# EAGLE board MJ838 - rev.1b (EAGLE 9.6.2)
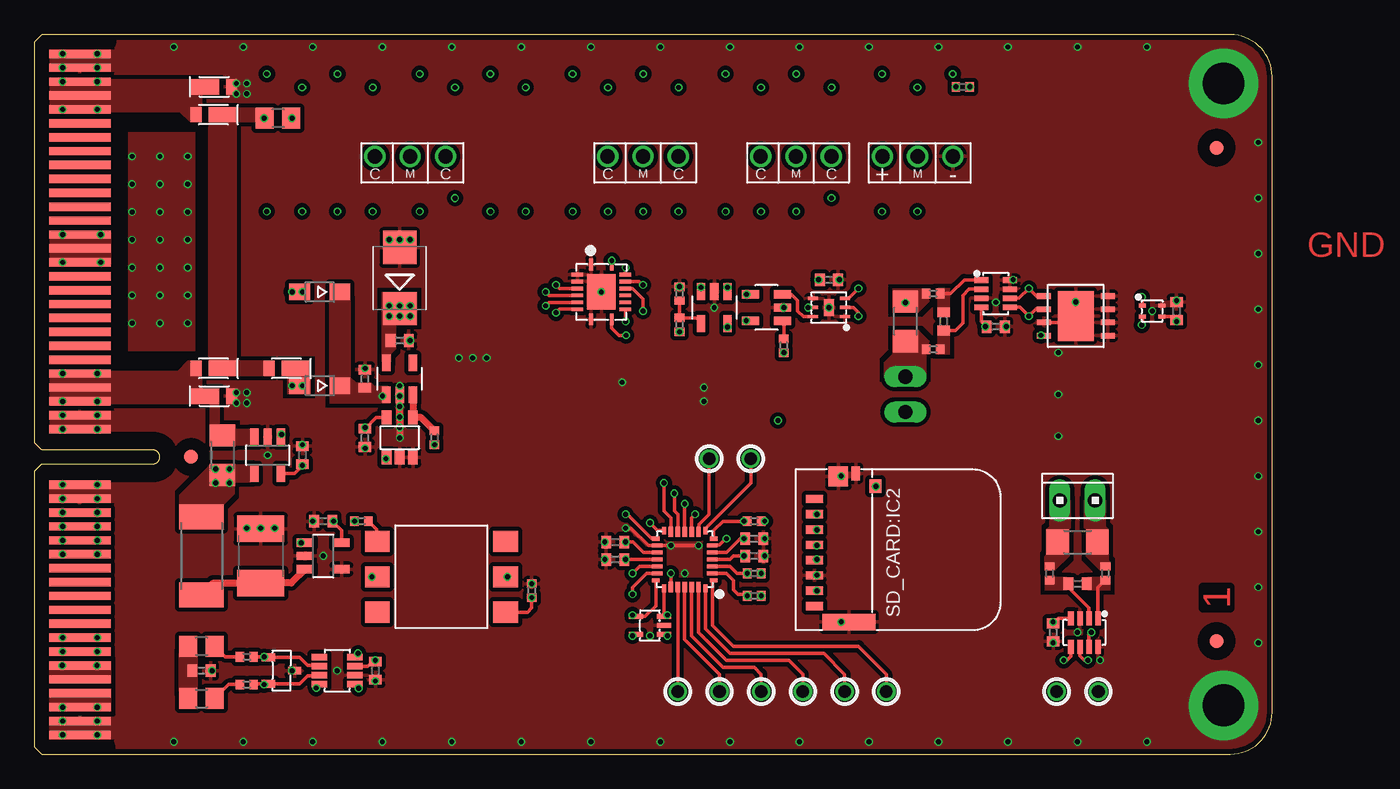
[diagram p20: board, top side]
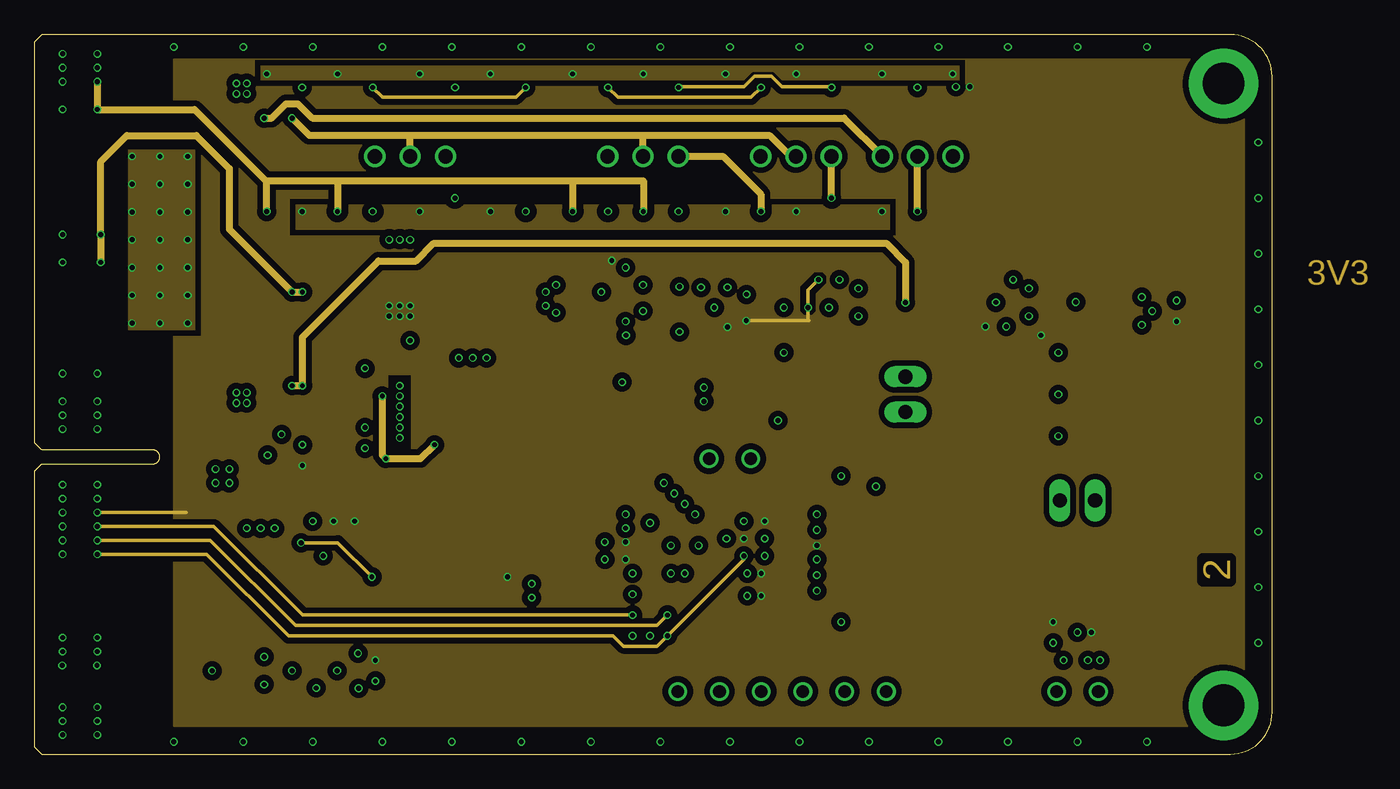
[diagram p21: board, inner layer Route2]
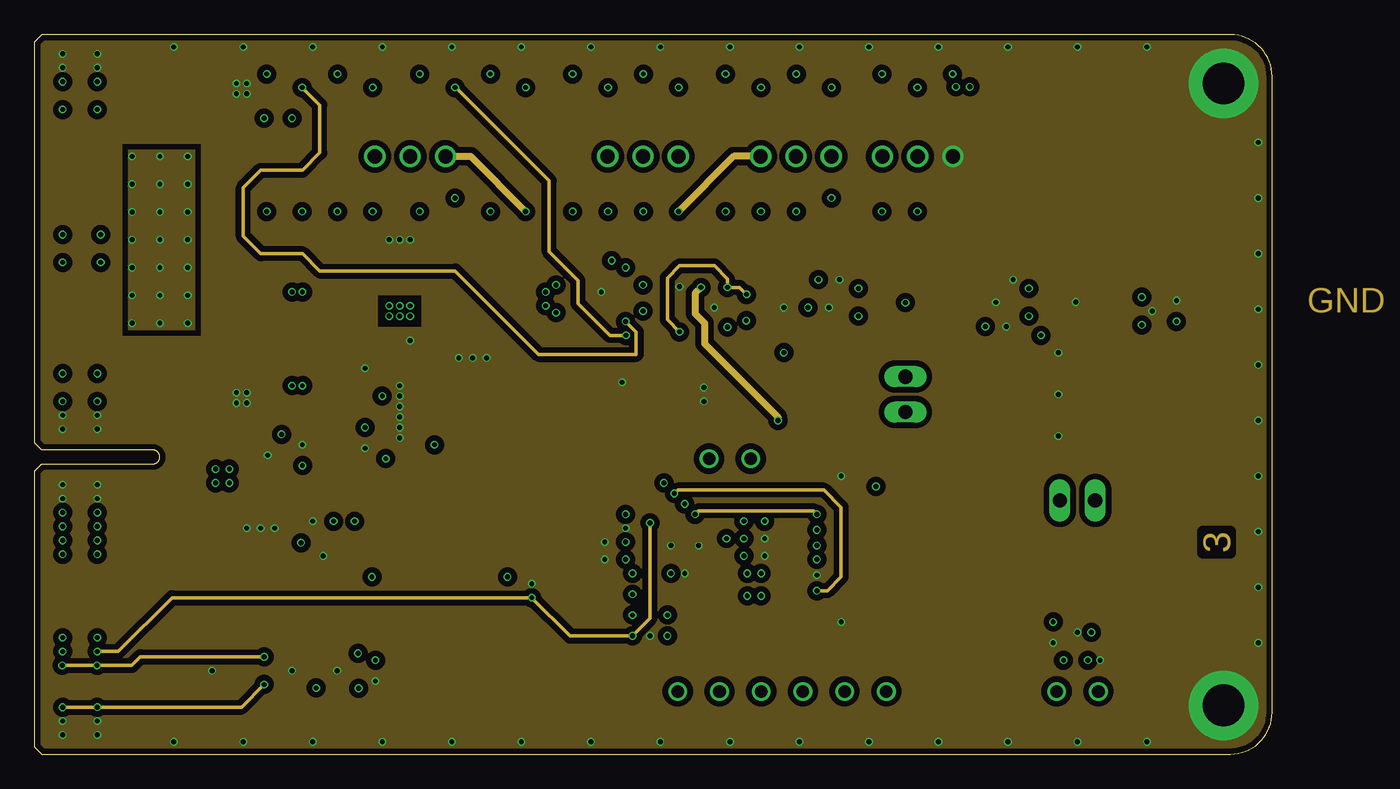
[diagram p22: board, inner layer Route3]
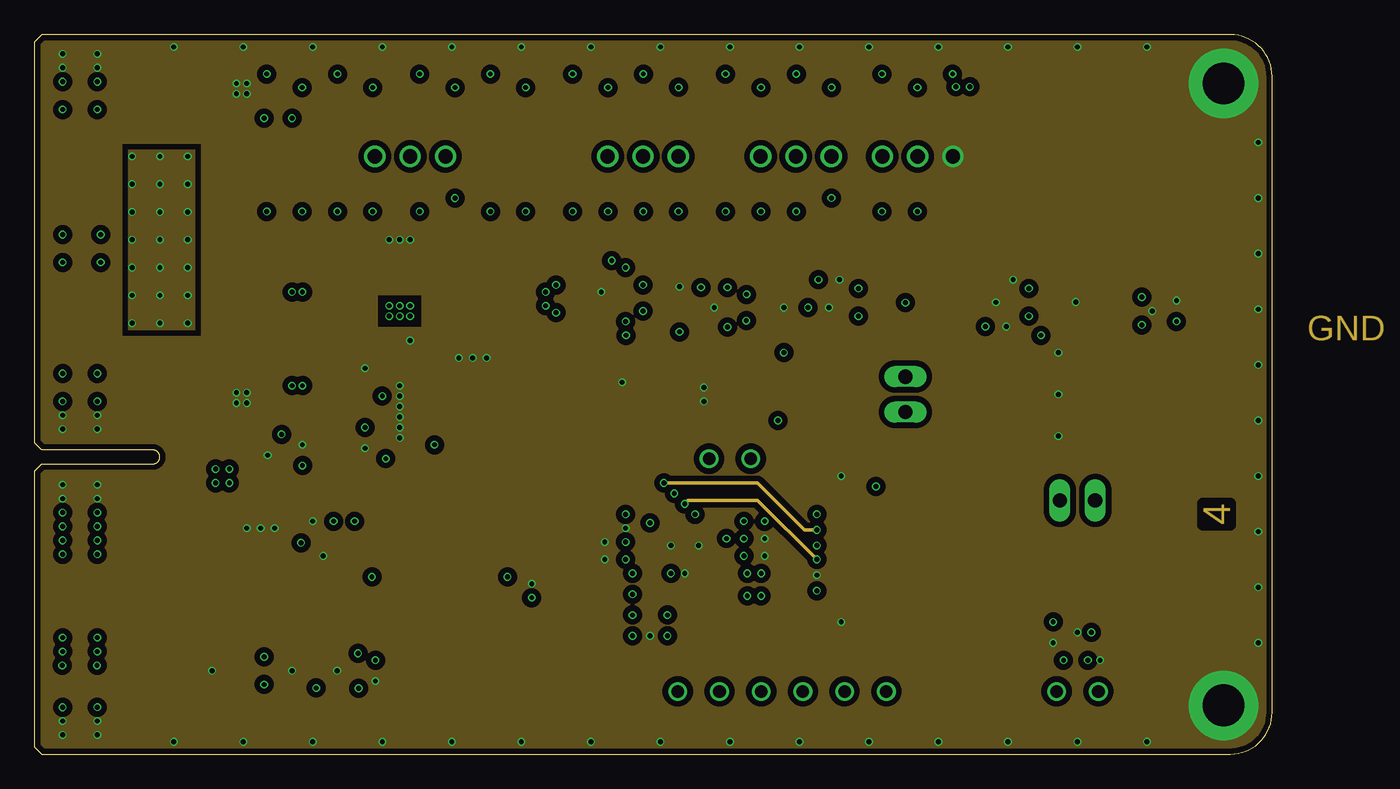
[diagram p23: board, inner layer Route14]
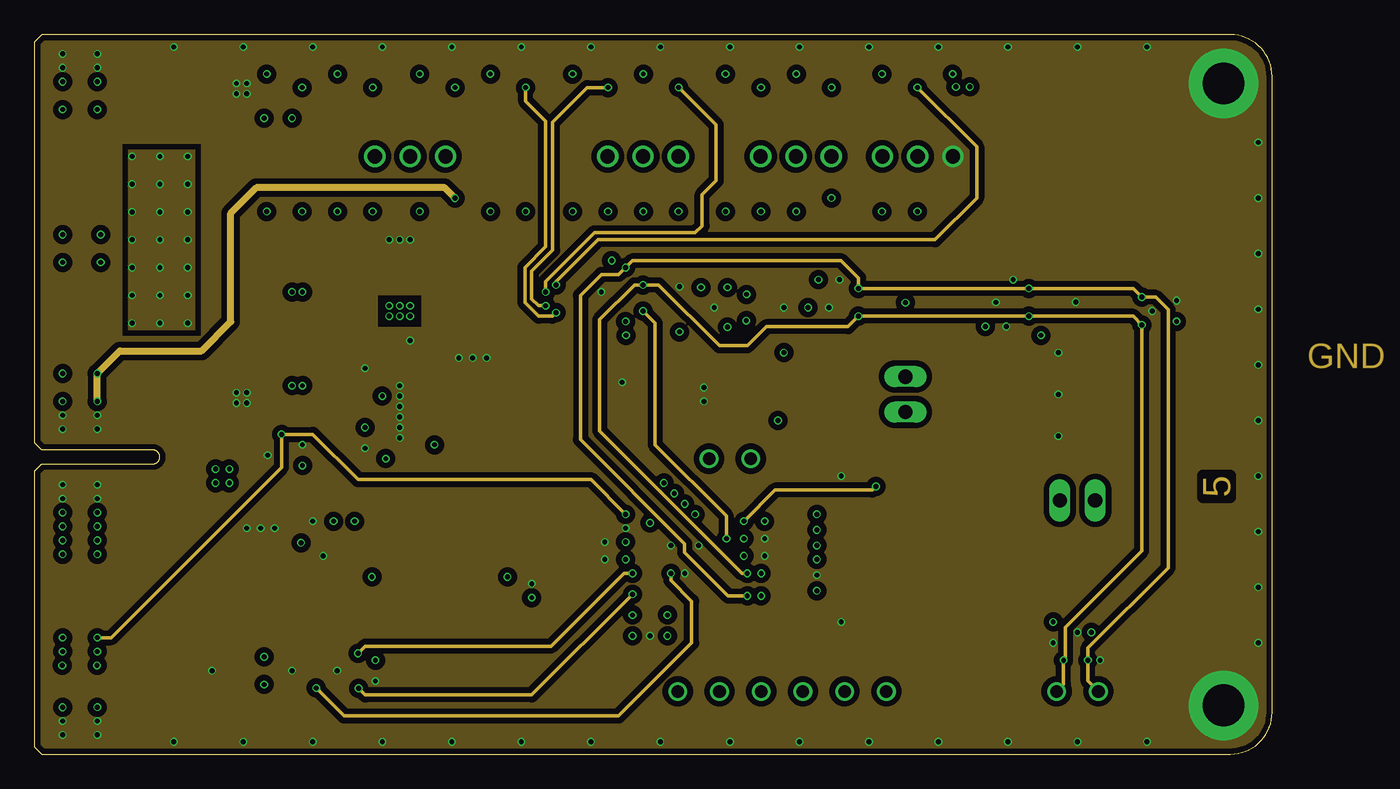
[diagram p24: board, inner layer Route15]
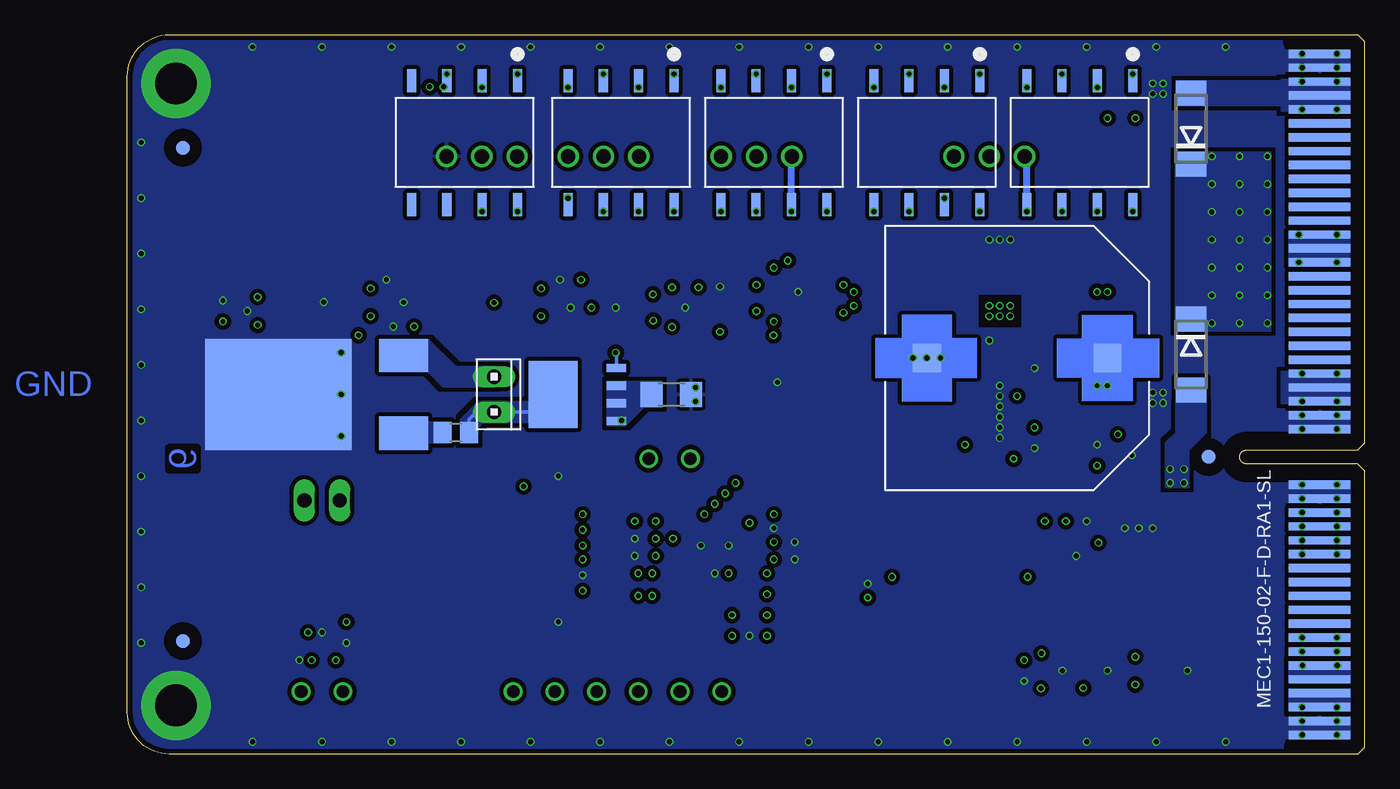
[diagram p25: board, bottom side, seen from below]

Size 89 x 51.75 mm. Coordinates in mm from the lower left corner, seen from the top.
Outline: 0.5,0 0,0.5 0,20.38 0.5,20.88 8.5,20.88 arc90 9,21.38 arc90 8.5,21.88 0.5,21.88 0,22.38 0,51.25 0.5,51.75 86,51.75 arc-90 89,48.75 89,3 arc-90 86,0 0.5,0
Copper layers (1*2*3*14*15*16): Top 0.0432mm / dielectric 0.1107mm / Route2 0.0175mm / dielectric 4mil / Route3 0.0175mm / dielectric 0.925575mm / Route14 0.0175mm / dielectric 4mil / Route15 0.0175mm / dielectric 0.1107mm / Bottom 0.0432mm
Design rules "oshpark-6layer": minimum track width 5mil, minimum drill 8mil, track to track 5mil, track to pad 5mil, pad to pad 5mil, via to via 5mil, smd to smd 5mil, copper to edge 15mil, drill to drill 6mil, minimum pad ring 4mil, minimum via ring 4mil, stop-mask expansion 1.5mil, vias tented up to drill 0mil, thermal gap 10mil
Net classes: 0 GND: width 0.25 mm, drill 0.35 mm, clearance 0.19 mm; 1 BAT+: width 0.5 mm, drill 0.35 mm, clearance 0.5 mm to class 0, clearance 0.5 mm; 2 signal: width 0.25 mm, drill 0.35 mm, clearance 0.19 mm to class 0, clearance 0.19 mm to class 1, clearance 0.19 mm; 3 3V3: width 0.25 mm, drill 0.35 mm, clearance 0.19 mm to class 0, clearance 0.19 mm to class 1, clearance 0.19 mm to class 2, clearance 0.19 mm; 4 Vdc: width 0.5 mm, drill 0.35 mm, clearance 0.5 mm to class 0, clearance 0.5 mm to class 1, clearance 0.5 mm to class 2, clearance 0.5 mm to class 3, clearance 0.5 mm; 5 Vdynamo: width 0.5 mm, drill 0.35 mm, clearance 0.5 mm to class 0, clearance 0.5 mm to class 1, clearance 0.5 mm to class 2, clearance 0.5 mm to class 3, clearance 0.5 mm to class 4, clearance 0.5 mm; 6 Vac: width 0.5 mm, drill 0.35 mm, clearance 0.5 mm to class 0, clearance 0.5 mm to class 1, clearance 0.5 mm to class 2, clearance 0.5 mm to class 3, clearance 0.5 mm to class 4, clearance 0.5 mm to class 5, clearance 0.5 mm

## Footprints (pad centres in the part's own frame; a part is rotated, then mirrored left to right if it is on the bottom)
C0402 = smd 0.7 x 0.9: 1 -0.65,0; 2 0.65,0
WSON-6 = smd 0.25 x 0.75: 1 -0.65,-1.15; 2 0,-1.15; 3 0.65,-1.15; 4 0.65,1.15; 5 0,1.15; 6 -0.65,1.15 | smd 1.2 x 0.75: 7 0,0
SOT-23-5 = smd 0.6 x 1.2: 1 0.95,1.15; 2 0,1.15; 3 -0.95,1.15; 4 -0.95,-1.15; 5 0.95,-1.15
SOT669 = smd 4.826 x 3.5: D 0,1.755 | smd 0.6 x 1.4: G 1.9,-2.8; S1 -1.91,-2.8; S2 -0.64,-2.8; S3 0.63,-2.8
10X02MTA = drill 1.016 long: 1 1.27,0; 2 -1.27,0
R0402 = smd 0.6 x 0.7: 1 -0.5,0; 2 0.5,0
R1206 = smd 1.6 x 1.803: 1 -1.422,0; 2 1.422,0
TO-263-2 = smd 2.4 x 3.5: 1 -2.8,1.75; 2 2.8,1.75 | smd 8 x 10.52: DIE 0,10.75
R0805 = smd 1.3 x 1.5: 1 -0.95,0; 2 0.95,0
SOT23-8 = smd 0.45 x 1.1: P$1 -0.975,-1.275; P$2 -0.325,-1.275; P$3 0.325,-1.275; P$4 0.975,-1.275; P$5 0.975,1.275; P$6 0.325,1.275; P$7 -0.325,1.275; P$8 -0.975,1.275
SOT-23-3 = smd 0.56 x 0.95: 1 -0.95,-0.95; 2 0.95,-0.95; 3 0,0.95
SMD = smd 4.45 x 0.6: 1 0,24.5; 3 0,23.5; 5 0,22.5; 7 0,21.5; 9 0,20.5; 11 0,19.5; 13 0,18.5; 15 0,17.5; 17 0,16.5; 19 0,15.5; 21 0,14.5; 23 0,13.5; 25 0,12.5; 27 0,11.5; 29 0,10.5; 31 0,9.5; 33 0,8.5; 35 0,7.5; 37 0,6.5; 45 0,2.5; 47 0,1.5; 49 0,0.5; 51 0,-0.5; 53 0,-1.5; 55 0,-2.5; 57 0,-3.5; 59 0,-4.5; 61 0,-5.5; 63 0,-6.5; 65 0,-7.5; 67 0,-8.5; 69 0,-9.5; 71 0,-10.5; 73 0,-11.5; 75 0,-12.5; 77 0,-13.5; 79 0,-14.5; 81 0,-15.5; 83 0,-16.5; 85 0,-17.5; 87 0,-18.5; 89 0,-19.5; 91 0,-20.5; 93 0,-21.5; 95 0,-22.5; 97 0,-23.5; 99 0,-24.5 | smd 4.45 x 0.6 bottom: 2 0,24.5; 4 0,23.5; 6 0,22.5; 8 0,21.5; 10 0,20.5; 12 0,19.5; 14 0,18.5; 16 0,17.5; 18 0,16.5; 20 0,15.5; 22 0,14.5; 24 0,13.5; 26 0,12.5; 28 0,11.5; 30 0,10.5; 32 0,9.5; 34 0,8.5; 36 0,7.5; 38 0,6.5; 46 0,2.5; 48 0,1.5; 50 0,0.5; 52 0,-0.5; 54 0,-1.5; 56 0,-2.5; 58 0,-3.5; 60 0,-4.5; 62 0,-5.5; 64 0,-6.5; 66 0,-7.5; 68 0,-8.5; 70 0,-9.5; 72 0,-10.5; 74 0,-11.5; 76 0,-12.5; 78 0,-13.5; 80 0,-14.5; 82 0,-15.5; 84 0,-16.5; 86 0,-17.5; 88 0,-18.5; 90 0,-19.5; 92 0,-20.5; 94 0,-21.5; 96 0,-22.5; 98 0,-23.5; 100 0,-24.5
SMB = smd 2.4 x 2.4: A 2.2,0; C -2.2,0
DFN8 = smd 1 x 0.4: 1 -2.3,1.425; 2 -2.3,0.475; 3 -2.3,-0.475; 4 -2.3,-1.425; 5 2.3,-1.425; 6 2.3,-0.475; 7 2.3,0.475; 8 2.3,1.425 | smd 2.6 x 3.6: G 0,0
FIDUCIAL_1MM = smd 1 x 1: 1 0,0
SMD' = smd 0.5 x 0.3: SCL -0.7,-0.4; SDA -0.7,0.4; VDD 0.7,-0.4; VSS 0.7,0.4
SOT323-5 = smd 1 x 0.35: GND -1,0; I1 -1,0.65; I2 -1,-0.65; I3 1,-0.65; I4 1,0.65
SOT-23-8 = smd 1 x 0.4: P$1 -1.025,0.975; P$2 -1.025,0.325; P$3 -1.025,-0.325; P$4 -1.025,-0.975; P$5 1.025,-0.975; P$6 1.025,-0.325; P$7 1.025,0.325; P$8 1.025,0.975
SOT23-5 = smd 0.7 x 1: 1_VDD -0.95,-1.4; 2_GND 0,-1.4; 3_GND 0.95,-1.4; 4_DOUT 0.95,1.45; 5_CD -0.95,1.45
SOT-23-5L = smd 0.6 x 1.2: ADJ/NC -0.95,-1.15; EN -0.95,1.15; GND 0,1.15; IN 0.95,1.15; OUT 0.95,-1.15
SOD323-W = smd 1.5 x 1.2: A 1.45,0; C -1.45,0
US2H = smd 2 x 1.1: A -1,0 | smd 0.8 x 1.1: C 0.9,0
TH-2S = drill 1.016: 1_POS -2.54,0; 2_MID 0,0; 3_NEG 2.54,0
SMD_DIP8 = smd 0.65 x 1.65: 1_ANODE1 -3.81,-4.44; 2_CATHODE1 -1.27,-4.44; 3_ANODE2 1.27,-4.44; 4_CATHODE2 3.81,-4.44; 5_DRAIN2-1 3.81,4.48; 6_DRAIN2-2 1.27,4.48; 7_DRAIN1-1 -1.27,4.48; 8_DRAIN1-2 -3.81,4.48
VQFN16 = smd 0.85 x 0.28: 1 -1.975,-0.75; 8 1.975,-0.75; 9 1.975,0.75; 16 -1.975,0.75 | smd 0.28 x 0.85: 2 -1.25,-1.725; 3 -0.75,-1.725; 4 -0.25,-1.725; 5 0.25,-1.725; 6 0.75,-1.725; 7 1.25,-1.725; 10 1.25,1.725; 11 0.75,1.725; 12 0.25,1.725; 13 -0.25,1.725; 14 -0.75,1.725; 15 -1.25,1.725 | smd 2.55 x 2.05: 17 0,0
TH-2S-BACK-TO-BACK = drill 1.016: 1_C -2.54,0; 2_MID 0,0; 3_C 2.54,0
DO214AA = smd 1.8 x 2.2: A 2.55,0; C -2.55,0
SOT23-5' = smd 0.6 x 1.2: 1 -0.95,-1.306; 2 0,-1.306; 3 0.95,-1.306; 4 0.95,1.306; 5 -0.95,1.306
CAP_EEEFK1E472SV = smd 2 x 2: + -6.5,0; - 6.5,0
C1812 = smd 1.9 x 3.4: 1 -1.95,0; 2 1.95,0
SMD-6 = smd 1.78 x 1.52: 1 -4.61,2.54; 2 -4.61,0; 3 -4.61,-2.54; 4 4.61,-2.54; 5 4.61,0; 6 4.61,2.54
R2512 = smd 1.8 x 3.2: 1 -2.8,0; 2 2.8,0
MICRO_SD_CONNECTOR = smd 0.6 x 1.25: CD/DAT3 2.75,-1.33; CLK -0.55,-1.33; CMD 1.65,-1.33; DAT0 -2.75,-1.33; DAT1 -3.85,-1.33; DAT2 3.85,-1.33; GND3 -1.65,-1.33; VDD 0.55,-1.33 | smd 0.95 x 0.85: DET 4.775,-5.723 | smd 1.2 x 3.79: GND1 -5,-3.81 | smd 1.45 x 1.4: GND2 5.475,-3.05 | smd 1 x 0.6: POL 5.7,-4.3
UFQFPN-28 = smd 0.55 x 0.3: 1_PB8 -2.08,1.5; 7_PA1 -2.08,-1.5; 15_PB1 2.08,-1.5; 21_PA13 2.08,1.5 | smd 0.75 x 0.3: 2_PF0 -1.98,1; 3_PF1 -1.98,0.5; 4_NRST -1.98,0; 5_VDDA -1.98,-0.5; 6_PA0 -1.98,-1; 16_VSS 1.98,-1; 17_VDD 1.98,-0.5; 18_VDDIO2 1.98,0; 19_PA9-[PA11] 1.98,0.5; 20_PA10-[PA12] 1.98,1 | smd 0.3 x 0.55: 8_PA2 -1.5,-2.08; 14_PB0 1.5,-2.08; 22_PA14 1.5,2.08; 28_PB7 -1.5,2.08 | smd 0.3 x 0.75: 9_PA3 -1,-1.98; 10_PA4 -0.5,-1.98; 11_PA5 0,-1.98; 12_PA6 0.5,-1.98; 13_PA7 1,-1.98; 23_PA15 1,1.98; 24_PB3 0.5,1.98; 25_PB4 0,1.98; 26_PB5 -0.5,1.98; 27_PB6 -1,1.98
TH-0.9 = drill 0.9: P$1 0,0

## Placement (x,y rotation side)
12R_OHMIC_LOAD:C1  0.1uF / 10V  [C0402]  57.12,34.12 180 top
12R_OHMIC_LOAD:IC1  DAC121C081CISD/NOPB  [WSON-6]  57.12,32.12 90 top
12R_OHMIC_LOAD:IC2  AD8515ARTZ-REEL7  [SOT-23-5]  52.62,32.12 270 top
12R_OHMIC_LOAD:IC3  PH2925U,115  [SOT669]  56.62,25.88 90 bottom
12R_OHMIC_LOAD:IC4  AD8515ARTZ-REEL7  [SOT-23-5]  48.88,32.12 0 top
12R_OHMIC_LOAD:J3  Application  [10X02MTA]  62.62,25.88 270 bottom
12R_OHMIC_LOAD:R1  1k  [R0402]  46.38,33.12 270 top
12R_OHMIC_LOAD:R2  0.1R / 0.5W - LVK12R100CER  [R1206]  49.88,25.88 180 bottom
12R_OHMIC_LOAD:R3  1k  [R0402]  53.88,29.38 270 top
12R_OHMIC_LOAD:R4  9k  [R0402]  46.38,30.88 270 top
12R_OHMIC_LOAD:R5  12R, 20W, AP725 12R F  [TO-263-2]  67.38,25.88 90 bottom
12R_OHMIC_LOAD:R6  0  [R0805]  65.38,23.12 180 bottom
CAN_INFRA:C1  47nF / 10V  [C0402]  12,6 0 top
CAN_INFRA:C5  0.1uF / 10V  [C0402]  24.5,6 270 top
CAN_INFRA:IC1  TCAN334GDCNT  [SOT23-8]  21.75,6 90 top
CAN_INFRA:IC2  SZNUP2105LT1G  [SOT-23-3]  17.75,6 270 top
CAN_INFRA:R1  60R, 0.5W  [R0805]  12,7.75 180 top
CAN_INFRA:R2  60R, 0.5W  [R0805]  12,4 0 top
CAN_INFRA:R3  0  [R0402]  15.25,5 0 top
CAN_INFRA:R4  0  [R0402]  15.25,7 0 top
CONN1  MEC1-150-02-F-D-RA1-SL  [SMD]  3.25,25.88 180 bottom
D1  SMLVT3V3  [SMB]  26.25,34.25 90 top
FE-RAM:IC1  FM24CL64B-DGTR  [DFN8]  74.88,31.52 180 top
FID1  n/a  [FIDUCIAL_1MM]  11.25,21.38 180 top
FID2  n/a  [FIDUCIAL_1MM]  85,8.12 0 bottom
FID3  n/a  [FIDUCIAL_1MM]  85,8.12 180 top
FID4  n/a  [FIDUCIAL_1MM]  11.25,21.38 0 bottom
FID5  n/a  [FIDUCIAL_1MM]  85,43.62 180 top
FID6  n/a  [FIDUCIAL_1MM]  85,43.62 0 bottom
HUMIDITY_SENSOR:C5  0.1uF / 10V  [C0402]  82.12,31.88 90 top
HUMIDITY_SENSOR:IC1  SHT40-AD1F-R2  [SMD']  80.38,31.88 0 top
IC1  ESDALC6V1W5  [SOT323-5]  44.25,9.25 180 top
INA1:C1  0.1uF / 10V  [C0402]  73.25,8.75 270 top
INA1:C2  ???  [C0402]  75,12.25 180 top
INA1:IC3  INA219BIDCNT  [SOT-23-8]  75.5,8.75 270 top
INA1:R3  ???  [R0402]  73,13 90 top
INA1:R4  0.1R / 0.5W - LVK12R100CER  [R1206]  75,15.25 180 top
INA1:R5  ???  [R0402]  77,13 90 top
INA219:C1  0.1uF / 10V  [C0402]  69.12,30.75 0 top
INA219:C2  ???  [C0402]  65.38,31.12 270 top
INA219:IC3  INA219BIDCNT  [SOT-23-8]  69.12,33.12 0 top
INA219:R3  ???  [R0402]  64.62,29.12 180 top
INA219:R4  0.1R / 0.5W - LVK12R100CER  [R1206]  62.62,31.12 270 top
INA219:R5  ???  [R0402]  64.62,33.12 180 top
J1  sense 1  [10X02MTA]  75,18.25 0 top
MARKER1  6 layer  [6L]  85,10.25 90 top
RECTIFIER:3V3:C1  1uF / 10V  [C0402]  23.75,22.75 270 top
RECTIFIER:3V3:C2  1uF / 10V  [C0402]  23.75,27 90 top
RECTIFIER:3V3:C7  1uF / 10V  [C0402]  26.25,29.75 180 top
RECTIFIER:3V3:IC1  R3119N058A  [SOT23-5]  26.25,22.75 0 top
RECTIFIER:3V3:IC2  LDK320AM33R  [SOT-23-5L]  26.25,27 180 top
RECTIFIER:3V3:R1  100k / 0.1W  [R0402]  28.75,22.75 90 top
RECTIFIER:D1  BAT 60A E6327  [SOD323-W]  20.5,33.25 180 top
RECTIFIER:D2  BAT 60A E6327  [SOD323-W]  20.5,26.5 180 top
RECTIFIER:GRAETZ+DELON:D1  CUHS20S30,H3F  [US2H]  12.5,46 180 top
RECTIFIER:GRAETZ+DELON:D2  CUHS20S30,H3F  [US2H]  13.25,48 0 top
RECTIFIER:GRAETZ+DELON:D3  CUHS20S30,H3F  [US2H]  12.5,27.75 180 top
RECTIFIER:GRAETZ+DELON:D4  CUHS20S30,H3F  [US2H]  13.25,25.75 0 top
RECTIFIER:GRAETZ+DELON:DELON:C1  330μF / 35V / ultralow ESR  [TH-2S]  63.5,43 0 top
RECTIFIER:GRAETZ+DELON:DELON:SSR_NO/NO3:IC1  LAA710S  [SMD_DIP8]  64.75,44 180 bottom
RECTIFIER:GRAETZ+DELON:IC1  TLC59208FIRGYR  [VQFN16]  40.75,33.25 270 top
RECTIFIER:GRAETZ+DELON:R1  625  [R0402]  66.75,48 0 top
RECTIFIER:GRAETZ+DELON:TUNING_CAPS:C2  1500μF / 35V / ultralow ESR  [TH-2S-BACK-TO-BACK]  27,43 0 top
RECTIFIER:GRAETZ+DELON:TUNING_CAPS:C3  1500μF / 35V / ultralow ESR  [TH-2S-BACK-TO-BACK]  43.75,43 0 top
RECTIFIER:GRAETZ+DELON:TUNING_CAPS:C4  1500μF / 35V / ultralow ESR  [TH-2S-BACK-TO-BACK]  54.75,43 0 top
RECTIFIER:GRAETZ+DELON:TUNING_CAPS:R2  47k  [R0805]  17.5,45.75 180 top
RECTIFIER:GRAETZ+DELON:TUNING_CAPS:SSR_NO/NO1:IC1  LAA710S  [SMD_DIP8]  42.5,44 180 bottom
RECTIFIER:GRAETZ+DELON:TUNING_CAPS:SSR_NO/NO2:IC1  LAA710S  [SMD_DIP8]  53.5,44 180 bottom
RECTIFIER:GRAETZ+DELON:TUNING_CAPS:SSR_NO/NO3:IC1  LAA710S  [SMD_DIP8]  20.5,44 180 bottom
RECTIFIER:GRAETZ+DELON:TUNING_CAPS:SSR_NO/NO4:IC1  LAA710S  [SMD_DIP8]  31.5,44 180 bottom
RECTIFIER:OVP:D1  19V/5W  [DO214AA]  12.5,45 90 bottom
RECTIFIER:OVP:D2  19V/5W  [DO214AA]  12.5,28.75 270 bottom
RECTIFIER:PHASE_SHIFT:C1  0.1uF / 10V  [C0402]  19.25,21.5 270 top
RECTIFIER:PHASE_SHIFT:IC1  LT1716CS5#TRMPBF  [SOT23-5']  16.75,21.5 180 top
RECTIFIER:PHASE_SHIFT:R4  0.01R / 0.5W / 0.25%  [R1206]  13.5,21.5 90 top
RECTIFIER:SMOOTHING_CAP:C1  EEE-FK1E472SV  [CAP_EEEFK1E472SV]  25,28.5 180 bottom
RECTIFIER:SMOOTHING_CAP:D8  CUHS20S30,H3F  [US2H]  17.75,27.75 180 top
RECTIFIER:ZERO-CROSS_DETECTOR:C3  0.1uF / 10V  [C0402]  20.75,16.75 0 top
RECTIFIER:ZERO-CROSS_DETECTOR:C8  10nF / 100v  [C1812]  16.25,14.25 270 top
RECTIFIER:ZERO-CROSS_DETECTOR:IC1  4N25-X009T  [SMD-6]  29.25,12.75 0 top
RECTIFIER:ZERO-CROSS_DETECTOR:IC3  LT1716CS5#TRMPBF  [SOT23-5']  20.75,14.25 270 top
RECTIFIER:ZERO-CROSS_DETECTOR:R1  10k/3W  [R2512]  12,14.25 270 top
RECTIFIER:ZERO-CROSS_DETECTOR:R2  100R  [R0402]  23.5,16.75 180 top
RECTIFIER:ZERO-CROSS_DETECTOR:R3  10k  [R0402]  35.75,11.75 270 top
SD_CARD:IC2  47309-2651  [MICRO_SD_CONNECTOR]  54.75,14.5 90 top
SD_CARD:R1  10k  [R0402]  51.75,16.75 0 top
STM32F04:C1  0.1uF / 10V  [C0402]  41.75,15.25 0 top
STM32F04:C4  1uF / 10V  [C0402]  51.75,15.5 180 top
STM32F04:C5  0.1uF / 10V  [C0402]  41.75,14 0 top
STM32F04:C7  0.1uF / 10V  [C0402]  51.75,14.25 180 top
STM32F04:IC2  STM32F042G6U6  [UFQFPN-28]  46.75,14 180 top
STM32F04:R1  4k7  [R0402]  51.75,11.38 0 top
STM32F04:R2  4k7  [R0402]  51.75,13 0 top
TP1  CAN high  [TH-0.9]  48.5,21.25 270 top
TP2  CAN high  [TH-0.9]  51.5,21.25 270 top
TP3  CAN high  [TH-0.9]  46.25,4.5 0 top
TP4  CAN high  [TH-0.9]  49.25,4.5 0 top
TP5  CAN high  [TH-0.9]  52.25,4.5 0 top
TP6  CAN high  [TH-0.9]  55.25,4.5 0 top
TP7  CAN high  [TH-0.9]  58.25,4.5 0 top
TP8  CAN high  [TH-0.9]  61.25,4.5 0 top
TP9  CAN high  [TH-0.9]  73.5,4.5 0 top
TP10  CAN high  [TH-0.9]  76.5,4.5 0 top

## Tracks (layer width: path | path; a pad name or v marks a point on that pad's centre or on a via)
2IN+
  pour Top (no thermals): 75.5,18.25 77,18.25 77,16.38 77.22,16.15 77.22,13.93 77.35,13.8 77.35,13.2 76.65,13.2 75.62,14.22 75.62,16.15 75.5,16.27
2IN-
  pour Top (no thermals): 73,18.25 74.5,18.25 74.5,16.27 74.38,16.15 74.38,14.22 73.35,13.2 72.65,13.2 72.65,14.22 72.78,14.35 72.78,16.15 73,16.38
3V3  (via drill 0.35)
  Top 0.25: CAN_INFRA:IC1.P$3 23.93,6.33 24.25,6.65 CAN_INFRA:C5.1 v24.5,6.75 | INA1:IC3.P$4 73.62,9.78 INA1:C1.1 v73.25,9.5 | INA219:IC3.P$4 68.1,31.12 INA219:C1.1 v68.38,30.75 | RECTIFIER:ZERO-CROSS_DETECTOR:IC3.5 22.06,16.09 RECTIFIER:ZERO-CROSS_DETECTOR:C3.2 v21.5,16.75 | STM32F04:IC2.17_VDD 43.77,14.5 43.02,15.25 v42.5,15.25 STM32F04:C1.2 | v82.12,31.12 82.17,31.18 HUMIDITY_SENSOR:C5.1 81.88,31.48 HUMIDITY_SENSOR:IC1.VDD | RECTIFIER:PHASE_SHIFT:IC1.5 18.69,20.19 v19.25,20.75 RECTIFIER:PHASE_SHIFT:C1.2 | v76,8.75 75.83,8.57 INA1:IC3.P$7 | RECTIFIER:GRAETZ+DELON:IC1.16 v41.5,35.5 | 12R_OHMIC_LOAD:IC4.5 v49.83,30.73 | 12R_OHMIC_LOAD:IC2.5 v51.17,31.18 | v72.38,30.12 72.4,30.1 FE-RAM:IC1.8 | 12R_OHMIC_LOAD:C1.2 v56.38,34.12 | 12R_OHMIC_LOAD:IC1.5 v55.62,32.12 | RECTIFIER:ZERO-CROSS_DETECTOR:IC1.5 v34,12.75 | v4.5,17.38 CONN1.33 v2,17.38 | v42.5,14 STM32F04:C5.2 STM32F04:IC2.18_VDDIO2 | STM32F04:C4.2 v51,15.5 50.75,15.5 49.75,14.5 STM32F04:IC2.5_VDDA | SD_CARD:IC2.VDD 56.2,15.05 v56.25,15 | SD_CARD:R1.2 v52.5,16.75
  Route2 0.25: v56.38,34.12 55.62,33.38 v55.62,32.12 55.62,31.23 55.67,31.18 v51.17,31.18 | v4.5,17.38 10.88,17.38
  Bottom 0.25: CONN1.33 v4.5,17.38
  other vias: 27,31.5 52.25,13 52.25,11.38 23,16.75 67.25,48 26.25,31.5 25.5,31.5 25.5,32.25 26.25,32.25 27,32.25
  pour Route2 (isolate 0.406, rank 6, no thermals): 10,2 87,2 87,50 10,50
  pour Top (no thermals): 27.45,30.85 25.95,30.85 25.95,29.12 25.6,28.77 25.6,28.25 25,28.25 25,33.25 27.45,33.25
12R_OHMIC_LOAD:DAC_OUT
  Top 0.25: 12R_OHMIC_LOAD:IC1.6 55.27,31.48 54.88,31.88 54.88,32.62 54.42,33.08 12R_OHMIC_LOAD:IC2.3
12R_OHMIC_LOAD:DRAIN
  Bottom 0.25: 12R_OHMIC_LOAD:IC3.D 59.65,24.61 12R_OHMIC_LOAD:J3.1 62.77,24.75 63.75,24.75 64.42,24.07 12R_OHMIC_LOAD:R6.1
  pour Bottom (no thermals): 60.12,25.38 63.77,25.38 65.08,24.07 65.08,22.38 63.77,22.38 63.77,23.48 63.4,23.85 60.12,23.85
12R_OHMIC_LOAD:GATE1  (via drill 0.35)
  Bottom 0.25: 12R_OHMIC_LOAD:IC3.G 53.83,28.82 12R_OHMIC_LOAD:R3.2
  other vias: 53.88,28.88
12R_OHMIC_LOAD:GATE-DRIVER_OUT
  Top 0.25: 12R_OHMIC_LOAD:R3.1 53.88,31.07 12R_OHMIC_LOAD:IC2.1
12R_OHMIC_LOAD:LOAD_LOW
  pour Bottom (no thermals): 65.88,23.88 67.62,23.88 67.62,22.38 65.88,22.38
12R_OHMIC_LOAD:N$1
  Top 0.25: 12R_OHMIC_LOAD:IC4.4 47.92,31.38 12R_OHMIC_LOAD:R4.1 12R_OHMIC_LOAD:R1.2
12R_OHMIC_LOAD:VSENSE  (via drill 0.35)
  Top 0.5: 12R_OHMIC_LOAD:IC4.3 v47.92,33.58
  Route3 0.5: v53.45,24 53.45,24.25 48.17,29.52 48.17,31 47.5,31.68 47.5,33.15 v47.92,33.58
  pour Bottom (no thermals): 50.5,26.8 54.52,26.8 54.52,23.65 53.12,23.65 51.8,24.98 50.5,24.98
12R_OHMIC_LOAD:VSENSE-AMP_OUT  (via drill 0.35)
  Top 0.25: 12R_OHMIC_LOAD:IC2.4 v51.2,33.08 | 12R_OHMIC_LOAD:IC4.1 v49.83,33.58
  Route3 0.25: 12R_OHMIC_LOAD:R4.2 45.5,31.25 45.5,34.25 46.38,35.12 48.88,35.12 49.83,34.17 v49.83,33.58 50.7,33.58 v51.2,33.08
  other vias: 46.38,30.38
!LED_RST!  (via drill 0.35)
  Top 0.25: RECTIFIER:GRAETZ+DELON:IC1.13 43,33.5 43.75,32.75 v43.75,31.88 | STM32F04:IC2.6_PA0 48.77,15.04 49.23,15.04 49.7,15.5 v49.75,15.5
  Route15 0.25: v49.75,15.5 49.75,17.12 44.62,22.25 44.62,31 v43.75,31.88
!STBY!  (via drill 0.35)
  Top 0.25: STM32F04:IC2.23_PA15 v45.75,13 | CAN_INFRA:IC1.P$8 20.25,4.8 v20.25,4.75
  Route15 0.25: v45.75,13 45.75,12.5 47.25,11 47.25,8 42,2.75 22.25,2.75 v20.25,4.75
ADJ_LOAD_HIGH
  pour Bottom (no thermals): 62.6,27.9 62.6,26.39 66.29,26.39 67.38,27.48 67.38,29.88 65.4,27.9
  pour Top (rank 2, no thermals): 61.73,28.77 61.09,28.14 61.09,27.14 64.15,27.14 64.15,28.77
  pour Top (rank 2, no thermals): 61.73,28.77 61.73,30.5 63.52,30.5 64.42,29.6 64.42,28.77
BAT+  (via drill 0.35)
  Top 0.5: v18.5,33.25 RECTIFIER:D1.A v19.25,33.25
  Route2 0.5: v4.75,35.38 v4.75,37.38 4.75,42.62 6.62,44.5 11.62,44.5 14,42.12 14,37.75 v18.5,33.25 v19.25,33.25
  other vias: 2,35.38 2,37.38
  pour Top (no thermals): 1.02,37.5 5.47,37.5 5.47,35.25 1.02,35.25
  pour Bottom (no thermals): 5.47,37.5 1.02,37.5 1.02,35.25 5.47,35.25
CAN_H  (via drill 0.35)
  Top 0.25: CAN_INFRA:IC1.P$7 20.43,5.62 19.62,5.62 19.05,5.05 CAN_INFRA:IC2.2 | CAN_INFRA:R3.2 15.8,5.05 CAN_INFRA:IC2.2 | CAN_INFRA:IC2.2 16.75,5 v16.5,5
  Route3 0.25: v2,3.36 2.01,3.38 v4.5,3.38 14.88,3.38 v16.5,5
  pour Top (no thermals): 1.02,4.67 5.47,4.67 5.47,3.08 1.02,3.08
  pour Bottom (no thermals): 5.47,4.67 1.02,4.67 1.02,3.08 5.47,3.08
CAN_INFRA:H
  Top 0.25: CAN_INFRA:R3.1 13.95,5 CAN_INFRA:R2.2
CAN_INFRA:L
  Top 0.25: CAN_INFRA:R4.1 13.7,7 CAN_INFRA:R1.1
CAN_INFRA:SPLIT
  pour Top (no thermals): 10.4,4.5 10.4,7.25 11.7,7.25 11.7,4.5
CAN_L  (via drill 0.35)
  Top 0.25: CAN_INFRA:IC1.P$6 20.43,6.38 19.62,6.38 19.05,6.95 CAN_INFRA:IC2.1 16.55,6.95 v16.5,7 CAN_INFRA:R4.2
  Route3 0.25: v1.98,6.38 v4.47,6.38 6.97,6.38 7.6,7 v16.5,7
  pour Top (no thermals): 1.02,6.67 5.47,6.67 5.47,5.08 1.02,5.08
  pour Bottom (no thermals): 5.47,6.67 1.02,6.67 1.02,5.08 5.47,5.08
CAN_RX  (via drill 0.35)
  Top 0.25: STM32F04:IC2.19_PA9-[PA11] 43.5,13.5 v43,13 | CAN_INFRA:IC1.P$4 23.02,7.03 v23.25,7.25
  Route15 0.25: v23.25,7.25 23.26,7.25 23.76,7.75 37.12,7.75 42.38,13 v43,13
CAN_TX  (via drill 0.35)
  Top 0.25: v43,11.5 43,12 44,13 STM32F04:IC2.20_PA10-[PA12] | CAN_INFRA:IC1.P$1 23.02,5 v23.3,4.72
  Route15 0.25: v23.3,4.72 23.77,4.25 35.75,4.25 v43,11.5
CLK  (via drill 0.35)
  Top 0.25: STM32F04:IC2.11_PA5 v46.75,18 | SD_CARD:IC2.CLK 56.2,13.95 v56.25,14
  Route14 0.25: v46.75,18 47,18.25 52,18.25 v56.25,14
CS  (via drill 0.35)
  Top 0.25: STM32F04:IC2.10_PA4 47.25,17 v47.5,17.25 | SD_CARD:IC2.CD/DAT3 v56.25,17.25
  Route3 0.25: v47.5,17.25 47.75,17.5 56,17.5 v56.25,17.25
DET  (via drill 0.35)
  Top 0.25: STM32F04:IC2.7_PA1 48.83,16.08 49.5,16.75 v51,16.75 SD_CARD:R1.1 | SD_CARD:IC2.DET v60.5,19.25
  Route15 0.25: v51,16.75 53.25,19 60.25,19 v60.5,19.25
DYNAMO1  (via drill 0.35)
  Route2 0.5: 16.65,41.25 21.77,41.25 | 21.77,41.25 v21.77,39.04 | 38.69,41.25 v38.69,39.04 | 21.77,41.25 38.69,41.25 | 38.69,41.25 43.77,41.25 v43.77,39.04 | v4.5,48.38 v4.5,46.38 11.5,46.38 16.62,41.25 16.65,41.25 | v16.69,39.04 16.69,41.21 16.65,41.25
  Bottom 0.5: RECTIFIER:GRAETZ+DELON:TUNING_CAPS:SSR_NO/NO3:IC1.6_DRAIN2-2 v21.77,39.04 | v16.69,39.04 RECTIFIER:GRAETZ+DELON:TUNING_CAPS:SSR_NO/NO3:IC1.8_DRAIN1-2 | RECTIFIER:GRAETZ+DELON:TUNING_CAPS:SSR_NO/NO1:IC1.8_DRAIN1-2 v38.69,39.04 | RECTIFIER:GRAETZ+DELON:TUNING_CAPS:SSR_NO/NO1:IC1.6_DRAIN2-2 v43.77,39.04
  other vias: 2,48.38 2,46.38
  pour Bottom (rank 2, no thermals): 6,48.58 1,48.58 1,46.2 6,46.2
  pour Top (rank 2, no thermals): 1.02,48.56 13.25,48.56 13.25,47.45 12,47.45 12,45.45 11.2,45.45 10.46,46.19 1.02,46.19
  pour Bottom (no thermals): 6,48.45 13.6,48.45 13.6,46.65 6,46.65
DYNAMO2  (via drill 0.35)
  Route15 0.5: v4.5,25.38 v4.5,27.38 6.12,29 12,29 14.1,31.1 14.1,38.9 15.94,40.74 29.49,40.74 v30.23,40
  Bottom 0.5: RECTIFIER:GRAETZ+DELON:TUNING_CAPS:SSR_NO/NO4:IC1.7_DRAIN1-1 v30.23,40
  other vias: 2,25.38 2,27.38
  pour Bottom (no thermals): 6,27.55 1,27.55 1,25.2 6,25.2
  pour Top (rank 2, no thermals): 13.25,25.2 1.02,25.2 1.02,27.56 10.31,27.56 11.05,28.3 12,28.3 12,26.3 13.25,26.3
  pour Top (rank 2, no thermals): 15.76,23.4 15.76,22.21 12.6,22.21 12.6,25.25 13.25,25.25 13.25,23.73 14.41,23.73 14.41,23.4
EXCL
  cutout Route3 (rank 2): 24.75,33 27.75,33 27.75,30.75 24.75,30.75
  cutout Route14 (rank 2): 24.75,33 27.75,33 27.75,30.75 24.75,30.75
  cutout Route15 (rank 2): 24.75,33 27.75,33 27.75,30.75 24.75,30.75
  cutout Bottom (rank 2): 24.75,33 27.75,33 27.75,30.75 24.75,30.75
  cutout Route2 (rank 2, no thermals): 25.5,27.25 27,27.25 27,22 25.5,22
GND  (via drill 0.35, 3 pad 5)
  Top 0.25: v42.5,16.25 42.9,16.25 44.15,15 STM32F04:IC2.16_VSS v47.75,15 | FE-RAM:IC1.7 74.53,31.05 74.88,31.4 v74.88,32.52
  Top 0.5: v26.25,22.75 v26.25,23.5 v26.25,24.25 v26.25,25 RECTIFIER:3V3:IC2.GND v26.25,26.5
  other vias: 85.5,3.5 85.5,48.25 88,12 88,16 88,20 88,24 88,28 80,0.88 75,0.88 70,0.88 65,0.88 60,0.88 55,0.88 50,0.88 45,0.88 40,0.88 35,0.88 30,0.88 25,0.88 20,0.88 15,0.88 10,0.88 80,50.88 75,50.88 70,50.88 65,50.88 60,50.88 55,50.88 50,50.88 45,50.88 40,50.88 35,50.88 30,50.88 25,50.88 20,50.88 15,50.88 10,50.88 57.88,34.12 57.12,32.12 53.88,32.12 48.88,32.12 46.38,33.62 18.5,6 24.5,5.25 21.75,6 12.75,6 23.75,22 27,29.75 23.75,27.75 26.25,25.75 73.62,22.88 73.62,25.88 73.62,28.88 48.12,25.38 48.12,26.38 73.25,8 76.62,6.75 69.88,30.75 70.38,34.12 75,8.75 69.12,32.5 40.75,33.25 52.5,14.25 52.5,15.5 41,15.25 41,14 15.25,16.25 16.25,16.25 17.25,16.25 20,16.75 20.75,14.25 35.75,12.25 88,8 88,32 88,36 88,40 88,44 2,50.38 2,49.38 2,24.38 2,23.38 2,19.38 2,18.38 2,2.38 2,1.38 4.5,50.38 4.5,49.38 4.5,24.38 4.5,23.38 4.5,19.38 4.5,18.38 4.5,2.38 4.5,1.38 82.12,32.62 80.38,31.88 19.25,22.25 16.75,21.5 44.25,8.5 46.75,13 26.25,37 25.5,37 27,37 14.5,26 14.5,25.25 15.25,26 15.25,25.25 31.5,28.5 30.5,28.5 32.5,28.5 14.5,48.25 14.5,47.5 15.25,48.25 15.25,47.5 42.25,26.75 56.25,12.88 58,20 58,9.5 45.75,15
  pour Route3 (isolate 0.406, rank 6, no thermals): -1,-1 90,-1 90,53 -1,53
  pour Top (isolate 0.305, rank 6): 90,53 -1,53 -1,-1 90,-1
  pour Route14 (isolate 0.406, rank 6, no thermals): -1,-1 90,-1 90,53 -1,53
  pour Route15 (isolate 0.406, rank 6, no thermals): -1,-1 90,-1 90,53 -1,53
  pour Bottom (isolate 0.305, rank 6): -1,-1 90,-1 90,53 -1,53
  pour Top (no thermals): 1.02,50.67 6,50.67 6,49.08 1.02,49.08
  pour Top (no thermals): 1.02,24.68 6,24.68 6,23.2 1.02,23.2
  pour Top (no thermals): 1.02,19.55 6,19.55 6,18.07 1.02,18.07
  pour Top (no thermals): 1,2.67 6,2.67 6,1.07 1,1.07
  pour Bottom (no thermals): 6,50.67 1,50.67 1,49.08 6,49.08
  pour Bottom (no thermals): 6,24.68 1,24.68 1,23.2 6,23.2
  pour Bottom (no thermals): 6,19.55 1,19.55 1,18.07 6,18.07
  pour Bottom (no thermals): 6,2.67 1,2.67 1,1.07 6,1.07
  pour Top (rank 3, no thermals): 13.75,26.62 13.75,24.75 15.5,24.75 15.5,26.62
  pour Top (rank 3, no thermals): 13.75,48.88 13.75,47 15.5,47 15.5,48.88
I2C_SCL  (via drill 0.35)
  Top 0.25: 12R_OHMIC_LOAD:IC1.2 58.88,32.12 59.25,31.75 v59.25,31.5 | v74,6.75 74.25,6.75 74.53,7.03 INA1:IC3.P$5 | STM32F04:IC2.3_PF1 50,13.5 50.5,13 STM32F04:R2.1 | v79.62,30.88 79.67,30.93 HUMIDITY_SENSOR:IC1.SCL | v43.75,33.75 43.73,33.75 43.48,34 RECTIFIER:GRAETZ+DELON:IC1.14 | INA219:IC3.P$5 70.85,32.15 v71.5,31.5 72,32 FE-RAM:IC1.6
  Route15 0.25: TP9.P$1 74,5 v74,6.75 74.12,6.88 74.12,9.12 79.62,14.62 v79.62,30.88 79,31.5 v71.5,31.5 v59.25,31.5 58.5,30.75 52.62,30.75 51.25,29.38 49.25,29.38 44.88,33.75 v43.75,33.75 43.12,33.75 40.62,31.25 40.62,23.25 50.88,13 STM32F04:R2.1
  other vias: 51.25,13
I2C_SDA  (via drill 0.35)
  Top 0.25: 12R_OHMIC_LOAD:IC1.3 58.52,32.77 v59.25,33.5 | v75.75,6.75 75.5,6.75 75.17,7.08 INA1:IC3.P$6 | STM32F04:IC2.2_PF0 49.75,13 50.25,12.5 50.25,11.83 50.58,11.5 51.12,11.5 STM32F04:R1.1 | v79.62,32.88 79.67,32.83 HUMIDITY_SENSOR:IC1.SDA | v42.5,35 42.48,34.98 RECTIFIER:GRAETZ+DELON:IC1.15 | INA219:IC3.P$6 70.8,32.8 v71.5,33.5 72.05,32.95 FE-RAM:IC1.5
  Route15 0.25: TP10.P$1 75.75,5.25 v75.75,6.75 75.75,7.62 81.53,13.41 81.53,31.97 80.62,32.88 v79.62,32.88 79,33.5 v71.5,33.5 v59.25,33.5 59.25,34.25 58,35.5 43,35.5 v42.5,35 42,34.5 40.75,34.5 39.25,33 39.25,22.62 46.75,15.12 46.75,14.5 49.88,11.38 STM32F04:R1.1
  other vias: 51.25,11.38
INA1:IN+L
  Top 0.25: INA1:IC3.P$1 76.47,11.97 INA1:R5.1
  pour Top (no thermals): 75.75,12.7 75.75,11.8 77.35,11.8 77.35,12.7
INA1:IN-H
  Top 0.25: INA1:IC3.P$2 75.83,10.53 74.35,12 INA1:C2.2
  pour Top (no thermals): 72.65,12.7 72.65,11.8 74.25,11.8 74.25,12.7
INA219:IN+L
  Top 0.25: INA219:R5.1 65.88,33.12 66.85,34.1 INA219:IC3.P$1
  pour Top (no thermals): 64.92,31.88 65.83,31.88 65.83,33.48 64.92,33.48
INA219:IN-H
  Top 0.25: INA219:IC3.P$2 67.2,33.45 66.75,33 66.75,31 66.22,30.48 INA219:C2.2
  pour Top (no thermals): 64.92,28.77 65.83,28.77 65.83,30.38 64.92,30.38
KEEPOUT
  cutout Route2: 55.12,31.88 55.12,33.62 56.12,34.62 56.62,34.62 56.88,34.38 56.88,33.88 56.12,33.12 56.12,31.88 55.88,31.62 55.38,31.62
LED1
  Top 0.25: STM32F04:IC2.9_PA3 47.78,16.02 47.78,16.54 48.5,17.25 TP1.P$1
LED2
  Top 0.25: STM32F04:IC2.8_PA2 48.25,16.25 51.5,19.5 TP2.P$1
MISO  (via drill 0.35)
  Top 0.25: STM32F04:IC2.12_PA6 46.25,17.25 46,17.5 v46,18.75 | SD_CARD:IC2.DAT0 v56.25,11.75
  Route3 0.25: v56.25,11.75 57,11.75 58,12.75 58,17.75 56.75,19 46.25,19 v46,18.75
MOSI  (via drill 0.35)
  Top 0.25: STM32F04:IC2.13_PA7 45.75,17 45.25,17.5 v45.25,19.5 | SD_CARD:IC2.CMD 56.1,16.12 v56.25,16.12
  Route14 0.25: v45.25,19.5 52,19.5 55.38,16.12 v56.25,16.12
PB3
  Top 0.25: TP3.P$1 STM32F04:IC2.24_PB3
PB4
  Top 0.25: TP4.P$1 49.25,5.75 46.75,8.25 STM32F04:IC2.25_PB4
PB5
  Top 0.25: STM32F04:IC2.26_PB5 47.25,8.5 49.5,6.25 51.75,6.25 52.25,5.75 TP5.P$1
PB6
  Top 0.25: STM32F04:IC2.27_PB6 47.75,8.75 49.75,6.75 54.25,6.75 55.25,5.75 TP6.P$1
PB7
  Top 0.25: STM32F04:IC2.28_PB7 48.25,9 50,7.25 56.75,7.25 58.25,5.75 TP7.P$1
PB8
  Top 0.25: STM32F04:IC2.1_PB8 48.75,12.42 48.75,9.25 50.25,7.75 59.25,7.75 61.25,5.75 TP8.P$1
PHASE  (via drill 0.35)
  Top 0.25: STM32F04:IC2.15_PB1 44.38,15.5 42.62,17.25 v42.5,17.25 | RECTIFIER:PHASE_SHIFT:IC1.1 17.7,22.95 v17.75,23 | CONN1.15 v4.5,8.38
  Route15 0.25: v42.5,17.25 40,19.75 23.25,19.75 20,23 v17.75,23 17.75,20.62 5.5,8.38 v4.5,8.38
  Bottom 0.25: v4.5,8.38 CONN1.15 v2,8.38
RECTIFIER:3V3:!EN!
  Top 0.5: RECTIFIER:3V3:IC2.EN RECTIFIER:3V3:IC1.4_DOUT 27.8,24.2 RECTIFIER:3V3:R1.2
RECTIFIER:3V3:CD  (via drill 0.35)
  Top 0.25: RECTIFIER:3V3:IC1.5_CD 24.55,24.2 RECTIFIER:3V3:C1.1 v23.75,23.5
RECTIFIER:AC  (via drill 0.35)
  other vias: 14,20.5 13,20.5 13,19.5 14,19.5
  pour Top (no thermals): 15.5,20.79 12.6,20.79 10.4,18.59 10.4,17.95 13.6,17.95 14.4,18.75 14.4,19.59 15.5,19.59
  pour Bottom (no thermals): 11.4,25.3 11.4,23.1 12.66,21.84 12.66,19.16 14.34,19.16 14.34,22.41 13.6,23.15 13.6,25.3
RECTIFIER:GRAETZ+DELON:!SW1!  (via drill 0.35)
  Top 0.25: RECTIFIER:GRAETZ+DELON:IC1.10 42.48,31.15 v42.5,31.12
  Route3 0.25: v19.23,47.95 20.5,46.69 20.5,43.25 19.25,42 16.25,42 15,40.75 15,37.25 16.25,36 19.25,36 20.5,34.75 30.25,34.75 36.25,28.75 43.25,28.75 43.25,30.38 v42.5,31.12
  Bottom 0.25: RECTIFIER:GRAETZ+DELON:TUNING_CAPS:SSR_NO/NO3:IC1.2_CATHODE1 v19.23,47.95
RECTIFIER:GRAETZ+DELON:!SW2!  (via drill 0.35)
  Top 0.25: v42.52,30.12 42.02,30.12 41.5,30.65 RECTIFIER:GRAETZ+DELON:IC1.9
  Route3 0.25: v30.23,47.95 30.3,47.95 37,41.25 37,36.15 39.08,34.08 39.08,32.42 41.38,30.12 v42.52,30.12
  Bottom 0.25: RECTIFIER:GRAETZ+DELON:TUNING_CAPS:SSR_NO/NO4:IC1.2_CATHODE1 v30.23,47.95
RECTIFIER:GRAETZ+DELON:!SW_CA!  (via drill 0.35)
  Top 0.25: RECTIFIER:GRAETZ+DELON:IC1.7 37.75,32 v37.5,31.75
  Route2 0.25: v24.31,47.95 25.02,47.25 34.61,47.25 v35.31,47.95
  Route15 0.25: v37.5,31.75 37.49,31.75 37.24,31.5 36.25,31.5 35.25,32.5 35.25,35 36.75,36.5 36.75,45.52 35.31,46.95 v35.31,47.95
  Bottom 0.25: RECTIFIER:GRAETZ+DELON:TUNING_CAPS:SSR_NO/NO3:IC1.4_CATHODE2 v24.31,47.95 | RECTIFIER:GRAETZ+DELON:TUNING_CAPS:SSR_NO/NO4:IC1.4_CATHODE2 v35.31,47.95
RECTIFIER:GRAETZ+DELON:!SW_CB!  (via drill 0.35)
  Top 0.25: RECTIFIER:GRAETZ+DELON:IC1.6 37,32.5 v36.75,32.25
  Route2 0.25: v41.23,47.95 41.94,47.25 51.52,47.25 v52.23,47.95
  Route15 0.25: v41.23,47.95 39.73,47.95 37.25,45.48 37.25,36.25 35.75,34.75 35.75,32.75 36.25,32.25 v36.75,32.25
  Bottom 0.25: RECTIFIER:GRAETZ+DELON:TUNING_CAPS:SSR_NO/NO1:IC1.2_CATHODE1 v41.23,47.95 | RECTIFIER:GRAETZ+DELON:TUNING_CAPS:SSR_NO/NO2:IC1.2_CATHODE1 v52.23,47.95
RECTIFIER:GRAETZ+DELON:!SW_CC!  (via drill 0.35)
  Top 0.25: RECTIFIER:GRAETZ+DELON:IC1.5 37,33 v36.75,33.25
  Route2 0.25: v57.31,47.95 57.27,48 53.75,48 53,48.75 51.75,48.75 51,48 46.35,48 v46.31,47.96
  Route15 0.25: v36.75,33.25 36.75,34 40.25,37.5 47.5,37.5 48,38 48,40.25 49,41.25 49,45.27 v46.31,47.96
  Bottom 0.25: RECTIFIER:GRAETZ+DELON:TUNING_CAPS:SSR_NO/NO1:IC1.4_CATHODE2 v46.31,47.96 | RECTIFIER:GRAETZ+DELON:TUNING_CAPS:SSR_NO/NO2:IC1.4_CATHODE2 v57.31,47.95
RECTIFIER:GRAETZ+DELON:!SW_CD!  (via drill 0.35)
  Top 0.25: RECTIFIER:GRAETZ+DELON:IC1.4 37.75,33.5 v37.5,33.75
  Route15 0.25: v37.5,33.75 37.5,34 40.5,37 64.75,37 67.75,40 67.75,43.69 v63.48,47.95
  Bottom 0.25: RECTIFIER:GRAETZ+DELON:DELON:SSR_NO/NO3:IC1.2_CATHODE1 v63.48,47.95
RECTIFIER:GRAETZ+DELON:DELON  (via drill 0.35)
  Bottom 0.5: RECTIFIER:GRAETZ+DELON:TUNING_CAPS:SSR_NO/NO3:IC1.7_DRAIN1-1 v19.23,39.04 | RECTIFIER:GRAETZ+DELON:TUNING_CAPS:SSR_NO/NO4:IC1.8_DRAIN1-2 v27.69,39.04 | RECTIFIER:GRAETZ+DELON:TUNING_CAPS:SSR_NO/NO4:IC1.6_DRAIN2-2 v32.77,39.04 | RECTIFIER:GRAETZ+DELON:TUNING_CAPS:SSR_NO/NO2:IC1.8_DRAIN1-2 v49.69,39.04 | RECTIFIER:GRAETZ+DELON:TUNING_CAPS:SSR_NO/NO2:IC1.6_DRAIN2-2 v54.77,39.04 | RECTIFIER:GRAETZ+DELON:DELON:SSR_NO/NO3:IC1.8_DRAIN1-2 v60.94,39.04
  pour Route2 (no thermals): 18.75,39.5 18.75,37.75 61.5,37.75 61.5,39.5
RECTIFIER:GRAETZ+DELON:DELON:SW1_OUT  (via drill 0.35)
  Route2 0.5: v63.48,39.04 63.48,42.98 RECTIFIER:GRAETZ+DELON:DELON:C1.2_MID
  Bottom 0.5: RECTIFIER:GRAETZ+DELON:DELON:SSR_NO/NO3:IC1.7_DRAIN1-1 v63.48,39.04
RECTIFIER:GRAETZ+DELON:SSR_ANODE  (via drill 0.35)
  Bottom 0.25: RECTIFIER:GRAETZ+DELON:TUNING_CAPS:SSR_NO/NO3:IC1.1_ANODE1 v16.69,48.92 | RECTIFIER:GRAETZ+DELON:TUNING_CAPS:SSR_NO/NO3:IC1.3_ANODE2 v21.77,48.92 | RECTIFIER:GRAETZ+DELON:TUNING_CAPS:SSR_NO/NO4:IC1.1_ANODE1 v27.69,48.92 | RECTIFIER:GRAETZ+DELON:TUNING_CAPS:SSR_NO/NO4:IC1.3_ANODE2 v32.77,48.92 | RECTIFIER:GRAETZ+DELON:TUNING_CAPS:SSR_NO/NO1:IC1.1_ANODE1 v38.69,48.92 | RECTIFIER:GRAETZ+DELON:TUNING_CAPS:SSR_NO/NO1:IC1.3_ANODE2 v43.77,48.92 | RECTIFIER:GRAETZ+DELON:TUNING_CAPS:SSR_NO/NO2:IC1.1_ANODE1 v49.69,48.92 | RECTIFIER:GRAETZ+DELON:TUNING_CAPS:SSR_NO/NO2:IC1.3_ANODE2 v54.77,48.92 | RECTIFIER:GRAETZ+DELON:DELON:SSR_NO/NO3:IC1.1_ANODE1 v60.94,48.92 | v66.02,48.92 RECTIFIER:GRAETZ+DELON:DELON:SSR_NO/NO3:IC1.3_ANODE2 66.25,48.21 RECTIFIER:GRAETZ+DELON:R1.1
  other vias: 66.25,48
  pour Route2 (no thermals): 16.25,49.5 16.25,48.5 66.5,48.5 66.5,49.5
RECTIFIER:GRAETZ+DELON:TUNING_CAPS:CAA  (via drill 0.35)
  Bottom 0.5: RECTIFIER:GRAETZ+DELON:TUNING_CAPS:C2.1_C 24.31,42.85 RECTIFIER:GRAETZ+DELON:TUNING_CAPS:SSR_NO/NO3:IC1.5_DRAIN2-1 v24.31,39.04
RECTIFIER:GRAETZ+DELON:TUNING_CAPS:CAB  (via drill 0.35)
  Route3 0.5: RECTIFIER:GRAETZ+DELON:TUNING_CAPS:C2.3_C 31.35,43 v35.31,39.04
  Bottom 0.5: RECTIFIER:GRAETZ+DELON:TUNING_CAPS:SSR_NO/NO4:IC1.5_DRAIN2-1 v35.31,39.04
RECTIFIER:GRAETZ+DELON:TUNING_CAPS:CBA  (via drill 0.35)
  Bottom 0.5: RECTIFIER:GRAETZ+DELON:TUNING_CAPS:C3.1_C 41.23,42.98 RECTIFIER:GRAETZ+DELON:TUNING_CAPS:SSR_NO/NO1:IC1.7_DRAIN1-1 v41.23,39.04
RECTIFIER:GRAETZ+DELON:TUNING_CAPS:CBB  (via drill 0.35)
  Route2 0.5: RECTIFIER:GRAETZ+DELON:TUNING_CAPS:C3.3_C 49.5,43 52.23,40.27 v52.23,39.04
  Bottom 0.5: RECTIFIER:GRAETZ+DELON:TUNING_CAPS:SSR_NO/NO2:IC1.7_DRAIN1-1 v52.23,39.04
RECTIFIER:GRAETZ+DELON:TUNING_CAPS:CCA  (via drill 0.35)
  Route3 0.5: RECTIFIER:GRAETZ+DELON:TUNING_CAPS:C4.1_C 50.27,43 v46.31,39.04
  Bottom 0.5: RECTIFIER:GRAETZ+DELON:TUNING_CAPS:SSR_NO/NO1:IC1.5_DRAIN2-1 v46.31,39.04
RECTIFIER:GRAETZ+DELON:TUNING_CAPS:CCB  (via drill 0.35)
  Route2 0.5: v57.31,40.01 57.29,40.02 RECTIFIER:GRAETZ+DELON:TUNING_CAPS:C4.3_C
  Bottom 0.5: RECTIFIER:GRAETZ+DELON:TUNING_CAPS:SSR_NO/NO2:IC1.5_DRAIN2-1 v57.31,40.01
RECTIFIER:GRAETZ+DELON:TUNING_CAPS:TUNING_CAP_BIAS  (via drill 0.35)
  Top 0.5: RECTIFIER:GRAETZ+DELON:TUNING_CAPS:R2.1 v18.5,45.75
  Route2 0.5: RECTIFIER:GRAETZ+DELON:TUNING_CAPS:C2.2_MID 27,44.51 | v18.5,45.75 19.74,44.51 27,44.51 | 27,44.51 43.75,44.51 | RECTIFIER:GRAETZ+DELON:TUNING_CAPS:C4.2_MID 54.35,43 52.84,44.51 43.75,44.51 | RECTIFIER:GRAETZ+DELON:TUNING_CAPS:C3.2_MID 43.75,44.51
RECTIFIER:LDO_IN  (via drill 0.35)
  Top 0.5: RECTIFIER:3V3:IC1.1_VDD 25.3,21.3 v25.25,21.25 | RECTIFIER:3V3:IC2.IN 25.2,25.75 v25,25.75
  Route2 0.5: v25,25.75 25,21.5 v25.25,21.25 27.75,21.25 RECTIFIER:3V3:R1.1
  other vias: 28.75,22.25
  pour Top (no thermals): 25.5,25.25 25.5,26.45 24.45,26.45 24.2,26.7 23.1,26.7 22.7,27.1 21.2,27.1 21.2,25.25
  pour Top (no thermals): 22.7,27.1 21.2,27.1 21.2,32.65 22.7,32.65
RECTIFIER:OVP:ZENER_COMMON  (via drill 0.35)
  other vias: 11,37 9,39 9,37 11,39 9,41 11,41 7,41 7,39 7,37 11,35 9,35 11,33 9,33 7,33 7,35 9,43 11,43 7,43 9,31 11,31 7,31
  pour Bottom (no thermals): 13.61,43.35 6.75,43.35 6.75,30.4 13.61,30.4
  pour Top (rank 2): 6.75,44.75 11.5,44.75 11.5,29 6.75,29
  pour Route3 (rank 2): 6.75,43.5 11.5,43.5 11.5,30.5 6.75,30.5
  pour Route14 (rank 2): 6.75,43.5 11.5,43.5 11.5,30.5 6.75,30.5
  pour Route15 (rank 2): 6.75,43.5 11.5,43.5 11.5,30.5 6.75,30.5
  pour Route2 (rank 2): 6.75,43.5 11.5,43.5 11.5,30.5 6.75,30.5
RECTIFIER:SMOOTHINGCAP_IN  (via drill 0.35)
  Top 0.5: RECTIFIER:GRAETZ+DELON:TUNING_CAPS:R2.2 v16.5,45.75
  Route2 0.5: RECTIFIER:GRAETZ+DELON:DELON:C1.1_POS 58.21,45.75 19.95,45.75 18.93,46.78 18.07,46.78 17.05,45.75 v16.5,45.75
  pour Top (rank 3, no thermals): 12.5,45.5 14.5,45.5 14.5,27.2 12.5,27.2
  pour Top (rank 2, no thermals): 14.5,28.3 16.5,28.3 16.5,27.2 14.5,27.2
  pour Top (rank 2, no thermals): 14.5,46.5 16,46.5 16,45.45 14.5,45.45
RECTIFIER:ZERO-CROSS_DETECTOR:COMPARATOR_OUT  (via drill 0.35)
  Top 0.25: RECTIFIER:ZERO-CROSS_DETECTOR:IC1.2 v24.25,12.75 | RECTIFIER:ZERO-CROSS_DETECTOR:IC3.1 v19.15,15.2
  Route2 0.25: v19.15,15.2 21.8,15.2 v24.25,12.75
RECTIFIER:ZERO-CROSS_DETECTOR:OPAMP_IN-
  Top 0.5: RECTIFIER:ZERO-CROSS_DETECTOR:R1.2 12.85,12.3 RECTIFIER:ZERO-CROSS_DETECTOR:C8.2 18.44,12.3 RECTIFIER:ZERO-CROSS_DETECTOR:IC3.3
RECTIFIER:ZERO-CROSS_DETECTOR:OPTO-ANODE
  Top 0.25: RECTIFIER:ZERO-CROSS_DETECTOR:IC1.1 24.6,15.25 24.6,16.15 RECTIFIER:ZERO-CROSS_DETECTOR:R2.1
SYS_NRST  (via drill 0.35)
  Top 0.25: STM32F04:IC2.4_NRST 50,14 50.25,14.25 v51,14.25 STM32F04:C7.2 | IC1.I1 45.4,8.6 v45.5,8.5 | v4.5,14.38 CONN1.28 v2,14.38
  Route2 0.25: v4.5,14.38 12.38,14.38 18.25,8.5 41.59,8.5 42.34,7.75 44.75,7.75 v45.5,8.5 51,14 v51,14.25
  Bottom 0.25: CONN1.28 v4.5,14.38
SYS_SWCLK  (via drill 0.35)
  Top 0.25: v4.5,15.38 CONN1.30 v2,15.38 | STM32F04:IC2.22_PA14 IC1.I2 45.4,9.9 v45.5,10
  Route2 0.25: v4.5,15.38 12.62,15.38 18.75,9.25 44.75,9.25 v45.5,10
  Bottom 0.25: CONN1.30 v4.5,15.38
SYS_SWDIO  (via drill 0.35)
  Top 0.25: v4.5,16.38 CONN1.32 v2,16.38 | STM32F04:IC2.21_PA13 44.67,10.67 43.9,9.9 IC1.I3 43.1,9.9 v43,10
  Route2 0.25: v4.5,16.38 12.88,16.38 19.25,10 v43,10
  Bottom 0.25: CONN1.32 v4.5,16.38
VDC  (via drill 0.35)
  Route2 0.5: v18.5,26.5 v19.25,26.5 19.25,30 24.72,35.47 27.43,35.47 28.7,36.75 61.25,36.75 62.62,35.38 v62.62,32.47
  Bottom 0.5: v18.5,26.5 RECTIFIER:SMOOTHING_CAP:C1.+
  pour Top (no thermals): 17.75,28.3 19.8,28.3 19.8,25.9 18.18,25.9 18.18,27.2 17.75,27.2
  pour Top (rank 2, no thermals): 61.73,31.75 61.73,33.48 64.42,33.48 64.42,32.65 63.52,31.75
ZEROCROSS  (via drill 0.35)
  Top 0.25: RECTIFIER:ZERO-CROSS_DETECTOR:IC1.4 35.46,10.21 35.75,10.5 RECTIFIER:ZERO-CROSS_DETECTOR:R3.2 | STM32F04:IC2.14_PB0 44.8,16.08 v44.25,16.62 | IC1.I4 43.15,8.5 v43,8.5 | v2,7.38 CONN1.14 v4.5,7.38
  Route3 0.25: v4.5,7.38 6,7.38 9.88,11.25 RECTIFIER:ZERO-CROSS_DETECTOR:R3.2 38.5,8.5 v43,8.5 44.25,9.75 v44.25,16.62
  Bottom 0.25: CONN1.14 v4.5,7.38
  other vias: 35.75,11.25

## Text on the board
Top: GND | GND | GND | GND
Route2: 3V3 | 3V3 | 3V3 | 3V3
Route3: GND | GND | GND | GND
Route14: GND | GND | GND | GND
Route15: GND | GND | GND | GND
Bottom: GND | GND | GND | GND
tStop: mj838 - Čos / HW rev.1b